# EAGLE design connector2 (EAGLE 9.0.0)
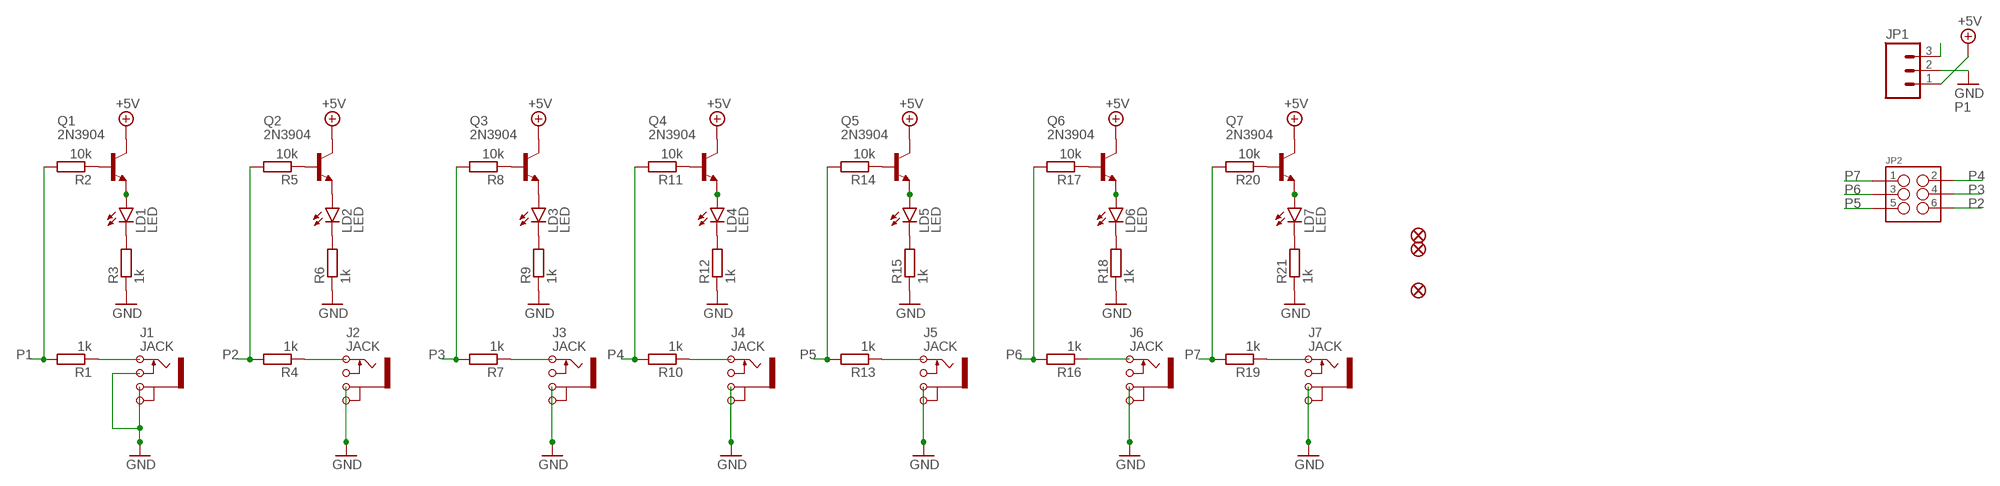
[diagram p0: schematic, sheet 1]

## Parts
FID1  FIDUCIAL  [FIDUCIAL]
FID2  FIDUCIAL  [FIDUCIAL]
FID3  FIDUCIAL  [FIDUCIAL]
J1  JACK  JACK_MONOJACK_MONO  [JACK_MONO]
J2  JACK  JACK_MONOJACK_MONO  [JACK_MONO]
J3  JACK  JACK_MONOJACK_MONO  [JACK_MONO]
J4  JACK  JACK_MONOJACK_MONO  [JACK_MONO]
J5  JACK  JACK_MONOJACK_MONO  [JACK_MONO]
J6  JACK  JACK_MONOJACK_MONO  [JACK_MONO]
J7  JACK  JACK_MONOJACK_MONO  [JACK_MONO]
JP1  M03LOCK  [1X03_LOCK]
JP2  M03X2NO_SILK  [2X3-NS]
LD1  LED  LED_THT  [LEDSMALLHOLES]
LD2  LED  LED_THT  [LEDSMALLHOLES]
LD3  LED  LED_THT  [LEDSMALLHOLES]
LD4  LED  LED_THT  [LEDSMALLHOLES]
LD5  LED  LED_THT  [LEDSMALLHOLES]
LD6  LED  LED_THT  [LEDSMALLHOLES]
LD7  LED  LED_THT  [LEDSMALLHOLES]
Q1  2N3904  [SOT23]
Q2  2N3904  [SOT23]
Q3  2N3904  [SOT23]
Q4  2N3904  [SOT23]
Q5  2N3904  [SOT23]
Q6  2N3904  [SOT23]
Q7  2N3904  [SOT23]
R1  1k  RESISTOR0603  [RESISTOR0603]
R2  10k  RESISTOR0603  [RESISTOR0603]
R3  1k  RESISTOR0603  [RESISTOR0603]
R4  1k  RESISTOR0603  [RESISTOR0603]
R5  10k  RESISTOR0603  [RESISTOR0603]
R6  1k  RESISTOR0603  [RESISTOR0603]
R7  1k  RESISTOR0603  [RESISTOR0603]
R8  10k  RESISTOR0603  [RESISTOR0603]
R9  1k  RESISTOR0603  [RESISTOR0603]
R10  1k  RESISTOR0603  [RESISTOR0603]
R11  10k  RESISTOR0603  [RESISTOR0603]
R12  1k  RESISTOR0603  [RESISTOR0603]
R13  1k  RESISTOR0603  [RESISTOR0603]
R14  10k  RESISTOR0603  [RESISTOR0603]
R15  1k  RESISTOR0603  [RESISTOR0603]
R16  1k  RESISTOR0603  [RESISTOR0603]
R17  10k  RESISTOR0603  [RESISTOR0603]
R18  1k  RESISTOR0603  [RESISTOR0603]
R19  1k  RESISTOR0603  [RESISTOR0603]
R20  10k  RESISTOR0603  [RESISTOR0603]
R21  1k  RESISTOR0603  [RESISTOR0603]

## Nets
+5V: JP1.1 Q1.C Q2.C Q3.C Q4.C Q5.C Q6.C Q7.C
GND: J1.G1 J1.G2 J1.SW J2.G1 J2.G2 J3.G1 J3.G2 J4.G1 J4.G2 J5.G1 J5.G2 J6.G1 J6.G2 J7.G1 J7.G2 JP1.2 R3.1 R6.1 R9.1 R12.1 R15.1 R18.1 R21.1
N$1: LD3.K(C) R9.2
N$2: Q1.B R2.1
N$3: LD2.K(C) R6.2
N$4: J3.T R7.1
N$5: J2.T R4.1
N$6: LD4.A Q4.E
N$7: LD3.A Q3.E
N$8: LD4.K(C) R12.2
N$9: LD5.A Q5.E
N$10: J4.T R10.1
N$11: LD5.K(C) R15.2
N$12: J5.T R13.1
N$13: LD6.A Q6.E
N$14: LD6.K(C) R18.2
N$15: J6.T R16.1
N$16: LD7.A Q7.E
N$17: J1.T R1.1
N$18: LD7.K(C) R21.2
N$19: J7.T R19.1
N$20: Q2.B R5.1
N$22: LD2.A Q2.E
N$23: Q3.B R8.1
N$24: Q4.B R11.1
N$25: Q5.B R14.1
N$26: LD1.A Q1.E
N$27: LD1.K(C) R3.2
N$28: Q6.B R17.1
N$29: Q7.B R20.1
P1: JP1.3 R1.2 R2.2
P2: JP2.6 R4.2 R5.2
P3: JP2.4 R7.2 R8.2
P4: JP2.2 R10.2 R11.2
P5: JP2.5 R13.2 R14.2
P6: JP2.3 R16.2 R17.2
P7: JP2.1 R19.2 R20.2
Unconnected: J2.SW J3.SW J4.SW J5.SW J6.SW J7.SW

## Library data of the parts
FID1-FID3 = BASTL_FIDUCIALS:FIDUCIAL; ASSEMBLED: no; TYPE: FID
J1-J7 = BASTL_CONNECTORS:JACK_MONO; ASSEMBLED: yes; ODOO: PJ301BM; TYPE: THT
JP1 = BASTL_PINHEADERS:M03: Header 3 Standard 3-pin 0.1" header. Use with straight break away headers (SKU : PRT-00116), right angle break away headers (PRT-00553), swiss pins (PRT-00743), machine pins (PRT-00117), and female headers (PRT-00115). Molex polarized connector foot print use with SKU : PRT-08232 with associated crimp pins and housings.
JP2 = BASTL_PINHEADERS:M03X2: 2x3 .1" header. Shrouded, with keying- CONN-10681 SMT- CONN-11415 Pogo pins- HW-11044
LD1-LD7 = BASTL_LEDS:LED_THT: [color]_[diameter]_[difused/clear] R_3mm_D; ASSEMBLED: yes; TYPE: THT
Q1-Q7 = BASTL_TRANZISTORS:2N3904; ASSEMBLED: yes; MAN: ON SEMICONDUCTOR; MPN: MMBT3904LT1G; TYPE: SMT
R1-R21 = BASTL_RESISTORS:RESISTOR0603; ASSEMBLED: yes; TYPE: SMT

## Board
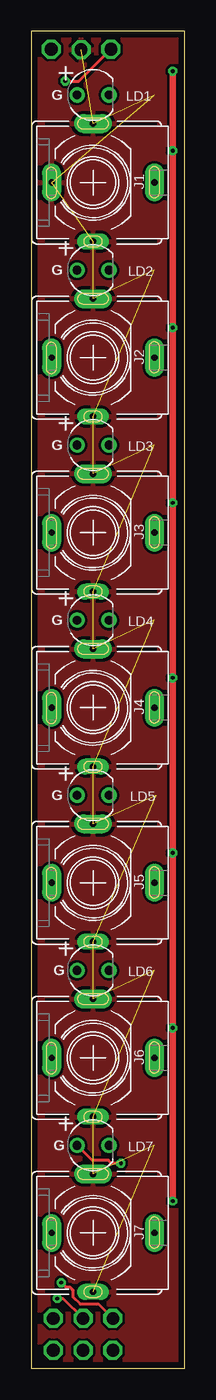
[diagram p1: board, top side]
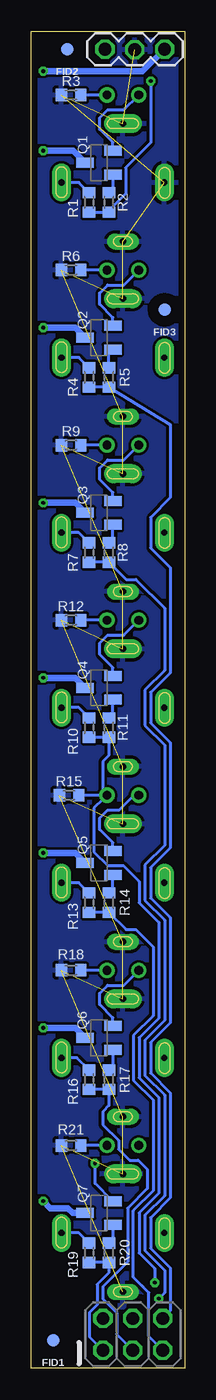
[diagram p2: board, bottom side, seen from below]

Size 12.22 x 106.68 mm. Coordinates in mm from the lower left corner, seen from the top.
Outline: 0,106.68 0,0 12.22,0 12.22,106.68 0,106.68
Copper layers (1*16): Top 0.035mm / dielectric 1.5mm / Bottom 0.035mm
Design rules "default *": minimum track width 10mil, minimum drill 24mil, track to track 8mil, track to pad 8mil, pad to pad 8mil, via to via 8mil, smd to smd 8mil, copper to edge 20mil, drill to drill 8mil, minimum pad ring 10mil, minimum via ring 8mil, stop-mask expansion 4mil, vias tented up to drill 0mil, thermal gap 10mil

### Footprints (pad centres in the part's own frame; a part is rotated, then mirrored left to right if it is on the bottom)
FIDUCIAL = smd 1 x 1: 2 0,0
JACK_MONO = drill 0.5 pad 1.524 long: G1 -4.7,0; SW 0,-3.3; T 0,4.9 | drill 0.5 pad 1.27 long: G2 4.7,0
1X03_LOCK = drill 1.016 octagon: 1 0.167,0; 2 2.54,0.032; 3 4.921,0
2X3-NS = drill 1.016 pad 1.524 octagon: 1 -2.381,-1.27; 2 -2.381,1.27; 3 0,-1.27; 4 0,1.27; 5 2.381,-1.27; 6 2.381,1.27
LEDSMALLHOLES = drill 0.7 pad 1.143: A -1.27,0; K 1.27,0
SOT23 = smd 0.8 x 1.4: B -0.95,-1.1; C 0,1.1; E 0.95,-1.1
RESISTOR0603 = smd 0.9 x 1: 1 -0.771,0; 2 0.771,0

### Placement (x,y rotation side)
FID1  10.48,2.22 0 bottom
FID2  9.37,105.25 0 bottom
FID3  1.59,84.45 0 bottom
J1  4.92,94.61 270 top
J2  4.92,80.64 270 top
J3  4.92,66.67 270 top
J4  4.92,52.7 270 top
J5  4.92,38.73 270 top
J6  4.92,24.77 270 top
J7  4.92,10.79 270 top
JP1  1.43,105.25 180 bottom
JP2  4.13,2.7 0 bottom
LD1  4.92,101.6 0 top
LD2  4.92,87.63 0 top
LD3  4.92,73.66 0 top
LD4  4.92,59.69 0 top
LD5  4.92,45.72 0 top
LD6  4.92,31.75 0 top
LD7  4.92,17.78 0 top
Q1  6.83,96.2 90 bottom
Q2  6.83,82.23 90 bottom
Q3  6.83,68.26 90 bottom
Q4  6.83,54.29 90 bottom
Q5  6.83,40.32 90 bottom
Q6  6.83,26.35 90 bottom
Q7  6.83,12.38 90 bottom
R1  7.62,93.03 270 bottom
R2  6.03,93.03 270 bottom
R3  9.05,101.6 0 bottom
R4  7.62,79.06 270 bottom
R5  6.03,79.06 270 bottom
R6  9.05,87.63 0 bottom
R7  7.62,65.09 270 bottom
R8  6.03,65.09 270 bottom
R9  9.05,73.66 0 bottom
R10  7.62,51.12 270 bottom
R11  6.03,51.12 270 bottom
R12  9.05,59.69 0 bottom
R13  7.62,37.15 270 bottom
R14  6.03,37.15 270 bottom
R15  9.21,45.72 0 bottom
R16  7.62,23.02 270 bottom
R17  6.03,23.02 270 bottom
R18  9.05,31.75 0 bottom
R19  7.62,9.21 270 bottom
R20  6.03,9.21 270 bottom
R21  9.05,17.78 0 bottom

### Tracks (layer width: path | path; a pad name or v marks a point on that pad's centre or on a via)
+5V  (via drill 0.3)
  Top 0.508: v11.27,103.5 v11.27,97.16 v11.27,83.03 v11.27,69.06 v11.27,55.09 v11.27,41.12 v11.27,27.15 v11.27,13.34
  Bottom 0.508: Q7.C 8.92,12.38 9.32,12.78 10.71,12.78 v11.27,13.34 | Q6.C 8.72,27.15 v11.27,27.15 | Q5.C 8.72,41.12 v11.27,41.12 | Q4.C 8.72,55.09 v11.27,55.09 | Q3.C 8.72,69.06 v11.27,69.06 | Q2.C 8.72,83.03 v11.27,83.03 | Q1.C 8.88,97.16 v11.27,97.16 | v11.27,103.5 3.38,103.5 JP1.1
GND  (22 unrouted)
  pour Bottom: -2.7,-3.02 21.43,-2.86 21.43,114.94 -3.02,114.94
  pour Top: -1.75,-1.59 16.99,-1.75 16.35,111.76 -1.75,111.76
N$1
  Bottom 0.254: LD3.K R9.2
N$2
  Bottom 0.254: Q1.B 5.73,94.1 R2.1
N$3
  Bottom 0.254: LD2.K R6.2
N$4
  Bottom 0.254: R7.1 8.44,66.67 J3.T
N$5
  Bottom 0.254: R4.1 8.44,80.64 J2.T
N$6
  Bottom 0.254: LD4.A 4.84,58.5 6.14,58.5 6.78,57.86 6.78,56.95 5.73,55.9 Q4.E
N$7
  Bottom 0.254: LD3.A 4.84,72.47 6.14,72.47 6.78,71.83 6.78,70.92 5.73,69.87 Q3.E
N$8
  Bottom 0.254: LD4.K R12.2
N$9
  Bottom 0.254: Q5.E 5.73,41.93 6.78,42.98 6.78,43.89 6.14,44.53 5.23,44.53 4.04,45.72 LD5.A
N$10
  Bottom 0.254: R10.1 8.44,52.7 J4.T
N$11
  Bottom 0.254: LD5.K R15.2
N$12
  Bottom 0.254: R13.1 8.44,38.73 J5.T
N$13
  Bottom 0.254: LD6.A 4.84,30.56 6.14,30.56 6.78,29.92 6.78,29.01 5.73,27.96 Q6.E
N$14
  Bottom 0.254: LD6.K R18.2
N$15
  Bottom 0.254: R16.1 8.6,24.77 J6.T
N$16  (via drill 0.3)
  Top 0.254: v7.14,16.35 6.37,16.35 6.14,16.59 4.84,16.59 LD7.A
  Bottom 0.254: Q7.E 7.14,14.75 v7.14,16.35
N$17
  Bottom 0.254: R1.1 8.44,94.61 J1.T
N$18
  Bottom 0.254: LD7.K R21.2
N$19
  Bottom 0.254: R19.1 8.44,10.79 J7.T
N$20
  Bottom 0.254: R5.1 6.03,80.98 Q2.B
N$22
  Bottom 0.254: LD2.A 4.84,86.44 6.14,86.44 6.78,85.8 6.78,84.89 5.73,83.84 Q2.E
N$23
  Bottom 0.254: R8.1 5.73,66.16 Q3.B
N$24
  Bottom 0.254: R11.1 5.73,52.19 Q4.B
N$25
  Bottom 0.254: R14.1 5.73,38.22 Q5.B
N$26
  Bottom 0.254: LD1.A 4.84,100.41 6.14,100.41 6.78,99.77 6.78,98.86 5.73,97.81 Q1.E
N$27
  Bottom 0.254: LD1.K R3.2
N$28
  Bottom 0.254: Q6.B 5.73,24.1 R17.1
N$29
  Bottom 0.254: Q7.B 5.73,10.28 R20.1
P1  (via drill 0.3)
  Top 0.254: v2.7,102.71 3.77,102.71 JP1.3
  Bottom 0.254: R1.2 R2.2 6.03,92.38 4.7,93.72 4.7,95.79 2.7,97.79 v2.7,102.71
P2
  Bottom 0.254: R4.2 R5.2 1.14,75.3 1.14,69.46 2.71,67.89 2.71,65.46 1.14,63.89 1.14,55.49 2.71,53.92 2.71,51.49 1.14,49.92 1.14,41.52 2.71,39.95 2.71,37.52 1.14,35.95 1.14,27.55 2.71,25.98 2.71,23.55 1.14,21.98 1.14,13.58 2.71,12.01 2.71,9.58 1.14,8.01 1.14,4.57 JP2.6
P3  (via drill 0.3)
  Top 0.254: JP2.4 2.54,5.56 v2.06,5.56
  Bottom 0.254: R7.2 R8.2 4.66,62.94 3.89,62.94 1.6,60.65 1.6,55.68 3.17,54.11 3.17,51.3 1.6,49.73 1.6,41.71 3.17,40.14 3.17,37.33 1.6,35.76 1.6,27.74 3.17,26.17 3.17,23.36 1.6,21.79 1.6,13.77 3.17,12.2 3.17,9.39 1.6,7.82 1.6,6.02 v2.06,5.56
P4  (via drill 0.3)
  Top 0.254: v2.38,6.83 2.73,6.48 3.07,6.48 3.19,6.36 3.32,6.22 3.32,5.7 3.89,5.13 5.35,5.13 JP2.2
  Bottom 0.254: R10.2 R11.2 6.03,48.89 6.52,48.41 6.52,45.4 7.23,44.69 7.23,41.21 6.12,40.1 4.89,40.1 3.63,38.84 3.63,37.14 2.06,35.57 2.06,27.93 3.63,26.36 3.63,23.17 2.06,21.6 2.06,13.96 3.63,12.39 3.63,9.2 2.38,7.96 v2.38,6.83
P5
  Bottom 0.254: R13.2 R14.2 4.66,35 3.89,35 2.52,33.63 2.52,28.12 4.08,26.55 4.08,22.98 2.52,21.41 2.52,14.15 4.08,12.58 4.08,7.26 3.41,6.59 3.32,6.5 2.86,6.03 2.86,2.54 JP2.5
P6
  Bottom 0.254: R16.2 R17.2 6.03,20.95 6.52,20.46 6.52,19.43 5.26,18.17 5.26,17.48 4.36,16.59 3.71,16.59 2.97,15.85 2.97,14.34 4.54,12.77 4.54,8.47 6.52,6.5 6.52,5.53 5.42,4.42 5.42,2.72 JP2.3
P7
  Bottom 0.254: R19.2 R20.2 6.03,7.63 6.98,6.68 6.98,5.04 7.6,4.42 7.6,2.52 JP2.1

### Text on the board
tPlace: G | G | G | G | G | G | G